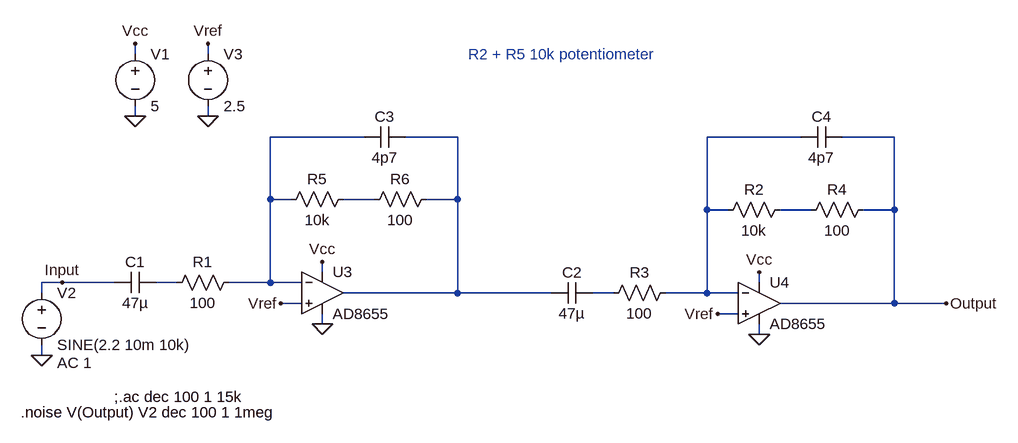
[diagram p0: schematic VGA_TIA_Potentiometer.asc]
VGA_TIA_Potentiometer.asc, the LTspice schematic file:
Version 4
SHEET 1 1208 680
WIRE -208 -48 -208 -64
WIRE -96 -48 -96 -64
WIRE -208 48 -208 32
WIRE -96 48 -96 32
WIRE 144 80 0 80
WIRE 288 80 208 80
WIRE 816 80 672 80
WIRE 960 80 880 80
WIRE 0 176 0 80
WIRE 32 176 0 176
WIRE 160 176 112 176
WIRE 288 176 288 80
WIRE 288 176 240 176
WIRE 672 192 672 80
WIRE 704 192 672 192
WIRE 832 192 784 192
WIRE 960 192 960 80
WIRE 960 192 912 192
WIRE 80 288 80 272
WIRE -320 304 -352 304
WIRE -240 304 -320 304
WIRE -144 304 -176 304
WIRE 0 304 0 176
WIRE 0 304 -64 304
WIRE 48 304 0 304
WIRE 752 304 752 288
WIRE -352 320 -352 304
WIRE 288 320 288 176
WIRE 288 320 112 320
WIRE 432 320 288 320
WIRE 528 320 496 320
WIRE 672 320 672 192
WIRE 672 320 608 320
WIRE 720 320 672 320
WIRE 48 336 16 336
WIRE 960 336 960 192
WIRE 960 336 784 336
WIRE 1040 336 960 336
WIRE 720 352 688 352
WIRE 80 368 80 352
WIRE 752 384 752 368
WIRE -352 416 -352 400
FLAG -208 48 0
FLAG -208 -64 Vcc
FLAG 80 368 0
FLAG 80 272 Vcc
FLAG -352 416 0
FLAG -96 48 0
FLAG -96 -64 Vref
FLAG -320 304 Input
FLAG 1040 336 Output
FLAG 16 336 Vref
FLAG 752 384 0
FLAG 752 288 Vcc
FLAG 688 352 Vref
SYMBOL voltage -208 -64 R0
WINDOW 123 0 0 Left 0
WINDOW 39 0 0 Left 0
SYMATTR InstName V1
SYMATTR Value 5
SYMBOL voltage -352 304 R0
WINDOW 123 24 124 Left 2
WINDOW 39 0 0 Left 0
SYMATTR Value2 AC 1
SYMATTR InstName V2
SYMATTR Value SINE(2.2 10m 10k)
SYMBOL voltage -96 -64 R0
WINDOW 123 0 0 Left 0
WINDOW 39 0 0 Left 0
SYMATTR InstName V3
SYMATTR Value 2.5
SYMBOL res 128 160 R90
WINDOW 0 0 56 VBottom 2
WINDOW 3 32 56 VTop 2
SYMATTR InstName R5
SYMATTR Value 10k
SYMBOL res -48 288 R90
WINDOW 0 0 56 VBottom 2
WINDOW 3 32 56 VTop 2
SYMATTR InstName R1
SYMATTR Value 100
SYMBOL cap -176 288 R90
WINDOW 0 0 32 VBottom 2
WINDOW 3 32 32 VTop 2
SYMATTR InstName C1
SYMATTR Value 47µ
SYMBOL res 800 176 R90
WINDOW 0 0 56 VBottom 2
WINDOW 3 32 56 VTop 2
SYMATTR InstName R2
SYMATTR Value 10k
SYMBOL res 624 304 R90
WINDOW 0 0 56 VBottom 2
WINDOW 3 32 56 VTop 2
SYMATTR InstName R3
SYMATTR Value 100
SYMBOL cap 496 304 R90
WINDOW 0 0 32 VBottom 2
WINDOW 3 32 32 VTop 2
SYMATTR InstName C2
SYMATTR Value 47µ
SYMBOL cap 208 64 R90
WINDOW 0 0 32 VBottom 2
WINDOW 3 32 32 VTop 2
SYMATTR InstName C3
SYMATTR Value 4p7
SYMBOL cap 880 64 R90
WINDOW 0 0 32 VBottom 2
WINDOW 3 32 32 VTop 2
SYMATTR InstName C4
SYMATTR Value 4p7
SYMBOL res 928 176 R90
WINDOW 0 0 56 VBottom 2
WINDOW 3 32 56 VTop 2
SYMATTR InstName R4
SYMATTR Value 100
SYMBOL res 256 160 R90
WINDOW 0 0 56 VBottom 2
WINDOW 3 32 56 VTop 2
SYMATTR InstName R6
SYMATTR Value 100
SYMBOL OpAmps\\AD8655 80 256 R0
SYMATTR InstName U3
SYMBOL OpAmps\\AD8655 752 272 R0
SYMATTR InstName U4
TEXT -240 480 Left 2 !;.ac dec 100 1 15k
TEXT -384 504 Left 2 !.noise V(Output) V2 dec 100 1 1meg
TEXT 304 -48 Left 2 ;R2 + R5 10k potentiometer

The netlist it stands for:
* VGA_TIA_Potentiometer.asc
V1 Vcc 0 5
V2 Input 0 SINE(2.2 10m 10k) AC 1
V3 Vref 0 2.5
R5 N004 N001 10k
R1 N001 N006 100
C1 N006 Input 47µ
R2 N005 N003 10k
R3 N003 N007 100
C2 N007 N002 47µ
C3 N002 N001 4p7
C4 Output N003 4p7
R4 Output N005 100
R6 N002 N004 100
XU3 Vref N001 Vcc 0 N002 AD8655  ; pins In+ In- V+ V- OUT
XU4 Vref N003 Vcc 0 Output AD8655  ; pins In+ In- V+ V- OUT
;.ac dec 100 1 15k
.noise V(Output) V2 dec 100 1 1meg
* R2 + R5 10k potentiometer
.backanno
.end